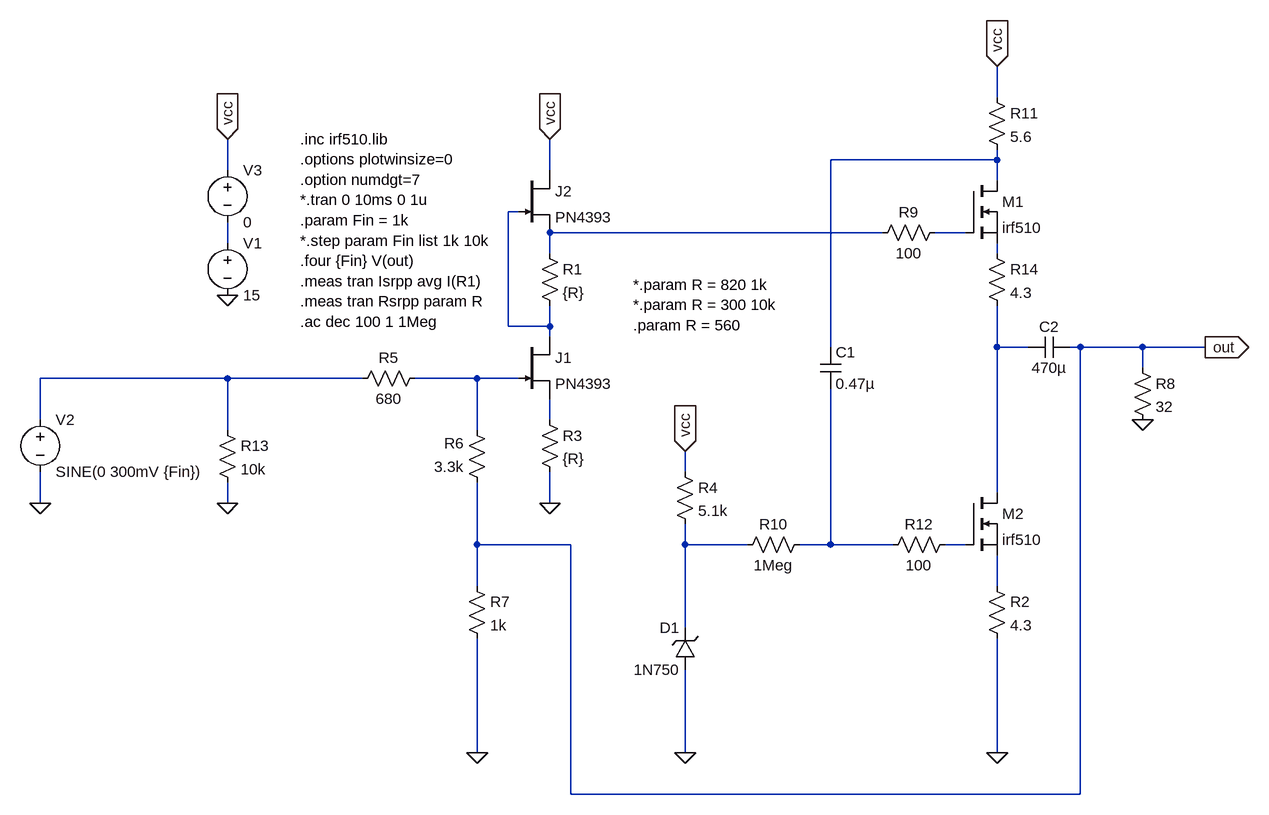
[diagram p0: schematic FET Only Power.asc]
FET Only Power.asc, the LTspice schematic file:
Version 4
SHEET 1 1460 964
WIRE 1056 -112 1056 -160
WIRE 1056 -16 1056 -32
WIRE 1056 -16 800 -16
WIRE -128 0 -128 -48
WIRE 368 0 368 -48
WIRE 1056 16 1056 -16
WIRE 320 64 304 64
WIRE 880 96 368 96
WIRE 1008 96 960 96
WIRE -128 112 -128 80
WIRE 368 128 368 96
WIRE 1056 128 1056 112
WIRE 304 240 304 64
WIRE 368 240 368 208
WIRE 368 240 304 240
WIRE 368 256 368 240
WIRE 800 272 800 -16
WIRE 1056 272 1056 208
WIRE 1104 272 1056 272
WIRE 1184 272 1168 272
WIRE 1280 272 1184 272
WIRE 1376 272 1280 272
WIRE 1280 304 1280 272
WIRE -128 320 -416 320
WIRE 80 320 -128 320
WIRE 256 320 160 320
WIRE 320 320 256 320
WIRE -416 384 -416 320
WIRE 368 384 368 352
WIRE -128 400 -128 320
WIRE 256 400 256 320
WIRE 576 464 576 432
WIRE 1056 496 1056 272
WIRE -416 512 -416 464
WIRE -128 512 -128 480
WIRE 368 512 368 464
WIRE 256 576 256 480
WIRE 400 576 256 576
WIRE 576 576 576 544
WIRE 672 576 576 576
WIRE 800 576 800 336
WIRE 800 576 752 576
WIRE 896 576 800 576
WIRE 1008 576 976 576
WIRE 256 640 256 576
WIRE 1056 640 1056 592
WIRE 576 704 576 576
WIRE 256 896 256 720
WIRE 576 896 576 768
WIRE 1056 896 1056 720
WIRE 400 960 400 576
WIRE 1184 960 1184 272
WIRE 1184 960 400 960
FLAG 368 512 0
FLAG -416 512 0
FLAG -128 -48 vcc
IOPIN -128 -48 In
FLAG -128 192 0
FLAG 368 -48 vcc
IOPIN 368 -48 In
FLAG 1056 -160 vcc
IOPIN 1056 -160 In
FLAG 1056 896 0
FLAG 576 432 vcc
IOPIN 576 432 In
FLAG 576 896 0
FLAG 1376 272 out
IOPIN 1376 272 Out
FLAG 256 896 0
FLAG 1280 384 0
FLAG -128 512 0
SYMBOL voltage -416 368 R0
SYMATTR InstName V2
SYMATTR Value SINE(0 300mV {Fin})
SYMATTR Value2 AC 1
SYMBOL voltage -128 96 R0
SYMATTR InstName V1
SYMATTR Value 15
SYMBOL res 352 368 R0
SYMATTR InstName R3
SYMATTR Value {R}
SYMBOL njf 320 256 R0
SYMATTR InstName J1
SYMATTR Value PN4393
SYMBOL res 352 112 R0
SYMATTR InstName R1
SYMATTR Value {R}
SYMBOL njf 320 0 R0
SYMATTR InstName J2
SYMATTR Value PN4393
SYMBOL res 1040 624 R0
SYMATTR InstName R2
SYMATTR Value 4.3
SYMBOL res 560 448 R0
SYMATTR InstName R4
SYMATTR Value 5.1k
SYMBOL nmos 1008 16 R0
SYMATTR InstName M1
SYMATTR Value irf510
SYMATTR Prefix X
SYMBOL res 176 304 R90
WINDOW 0 0 56 VBottom 2
WINDOW 3 32 56 VTop 2
SYMATTR InstName R5
SYMATTR Value 680
SYMBOL res 272 496 R180
WINDOW 0 36 76 Left 2
WINDOW 3 36 40 Left 2
SYMATTR InstName R6
SYMATTR Value 3.3k
SYMBOL res 240 624 R0
SYMATTR InstName R7
SYMATTR Value 1k
SYMBOL cap 1168 256 R90
WINDOW 0 0 32 VBottom 2
WINDOW 3 32 32 VTop 2
SYMATTR InstName C2
SYMATTR Value 470µ
SYMBOL res 1264 288 R0
SYMATTR InstName R8
SYMATTR Value 32
SYMBOL res 976 80 R90
WINDOW 0 0 56 VBottom 2
WINDOW 3 32 56 VTop 2
SYMATTR InstName R9
SYMATTR Value 100
SYMBOL res 768 560 R90
WINDOW 0 0 56 VBottom 2
WINDOW 3 32 56 VTop 2
SYMATTR InstName R10
SYMATTR Value 1Meg
SYMBOL res 1040 -128 R0
SYMATTR InstName R11
SYMATTR Value 5.6
SYMBOL cap 784 272 R0
SYMATTR InstName C1
SYMATTR Value 0.47µ
SYMBOL nmos 1008 496 R0
SYMATTR InstName M2
SYMATTR Value irf510
SYMATTR Prefix X
SYMBOL res 992 560 R90
WINDOW 0 0 56 VBottom 2
WINDOW 3 32 56 VTop 2
SYMATTR InstName R12
SYMATTR Value 100
SYMBOL zener 592 768 R180
WINDOW 0 24 64 Left 2
WINDOW 3 24 0 Left 2
SYMATTR InstName D1
SYMATTR Value 1N750
SYMBOL res -144 384 R0
SYMATTR InstName R13
SYMATTR Value 10k
SYMBOL voltage -128 -16 R0
SYMATTR InstName V3
SYMATTR Value 0
SYMBOL res 1040 112 R0
SYMATTR InstName R14
SYMATTR Value 4.3
TEXT -16 -48 Left 2 !.inc irf510.lib\n.options plotwinsize=0\n.option numdgt=7\n*.tran 0 10ms 0 1u\n.param Fin = 1k\n*.step param Fin list 1k 10k\n.four {Fin} V(out)\n.meas tran Isrpp avg I(R1)\n.meas tran Rsrpp param R\n.ac dec 100 1 1Meg
TEXT 496 176 Left 2 !*.param R = 820 1k\n*.param R = 300 10k\n.param R = 560

The netlist it stands for:
* FET Only Power.asc
V2 N008 0 SINE(0 300mV {Fin}) AC 1
V1 N005 0 15
R3 N010 0 {R}
J1 N002 N009 N010 PN4393
R1 N003 N002 {R}
J2 vcc N002 N003 PN4393
R2 N014 0 4.3
R4 vcc N011 5.1k
XM1 N001 N004 N006 irf510  ; pins D G S
R5 N009 N008 680
R6 out N009 3.3k
R7 out 0 1k
C2 out N007 470µ
R8 out 0 32
R9 N004 N003 100
R10 N012 N011 1Meg
R11 vcc N001 5.6
C1 N001 N012 0.47µ
XM2 N007 N013 N014 irf510  ; pins D G S
R12 N013 N012 100
D1 0 N011 1N750
R13 N008 0 10k
V3 vcc N005 0
R14 N006 N007 4.3
.model D D
.lib standard.dio
.model NJF NJF
.model PJF PJF
.lib standard.jft
.inc irf510.lib
.options plotwinsize=0
.option numdgt=7
*.tran 0 10ms 0 1u
.param Fin = 1k
*.step param Fin list 1k 10k
.four {Fin} V(out)
.meas tran Isrpp avg I(R1)
.meas tran Rsrpp param R
.ac dec 100 1 1Meg
*.param R = 820 1k
*.param R = 300 10k
.param R = 560
.backanno
.end